# EAGLE design accra004 (EAGLE 5.03)
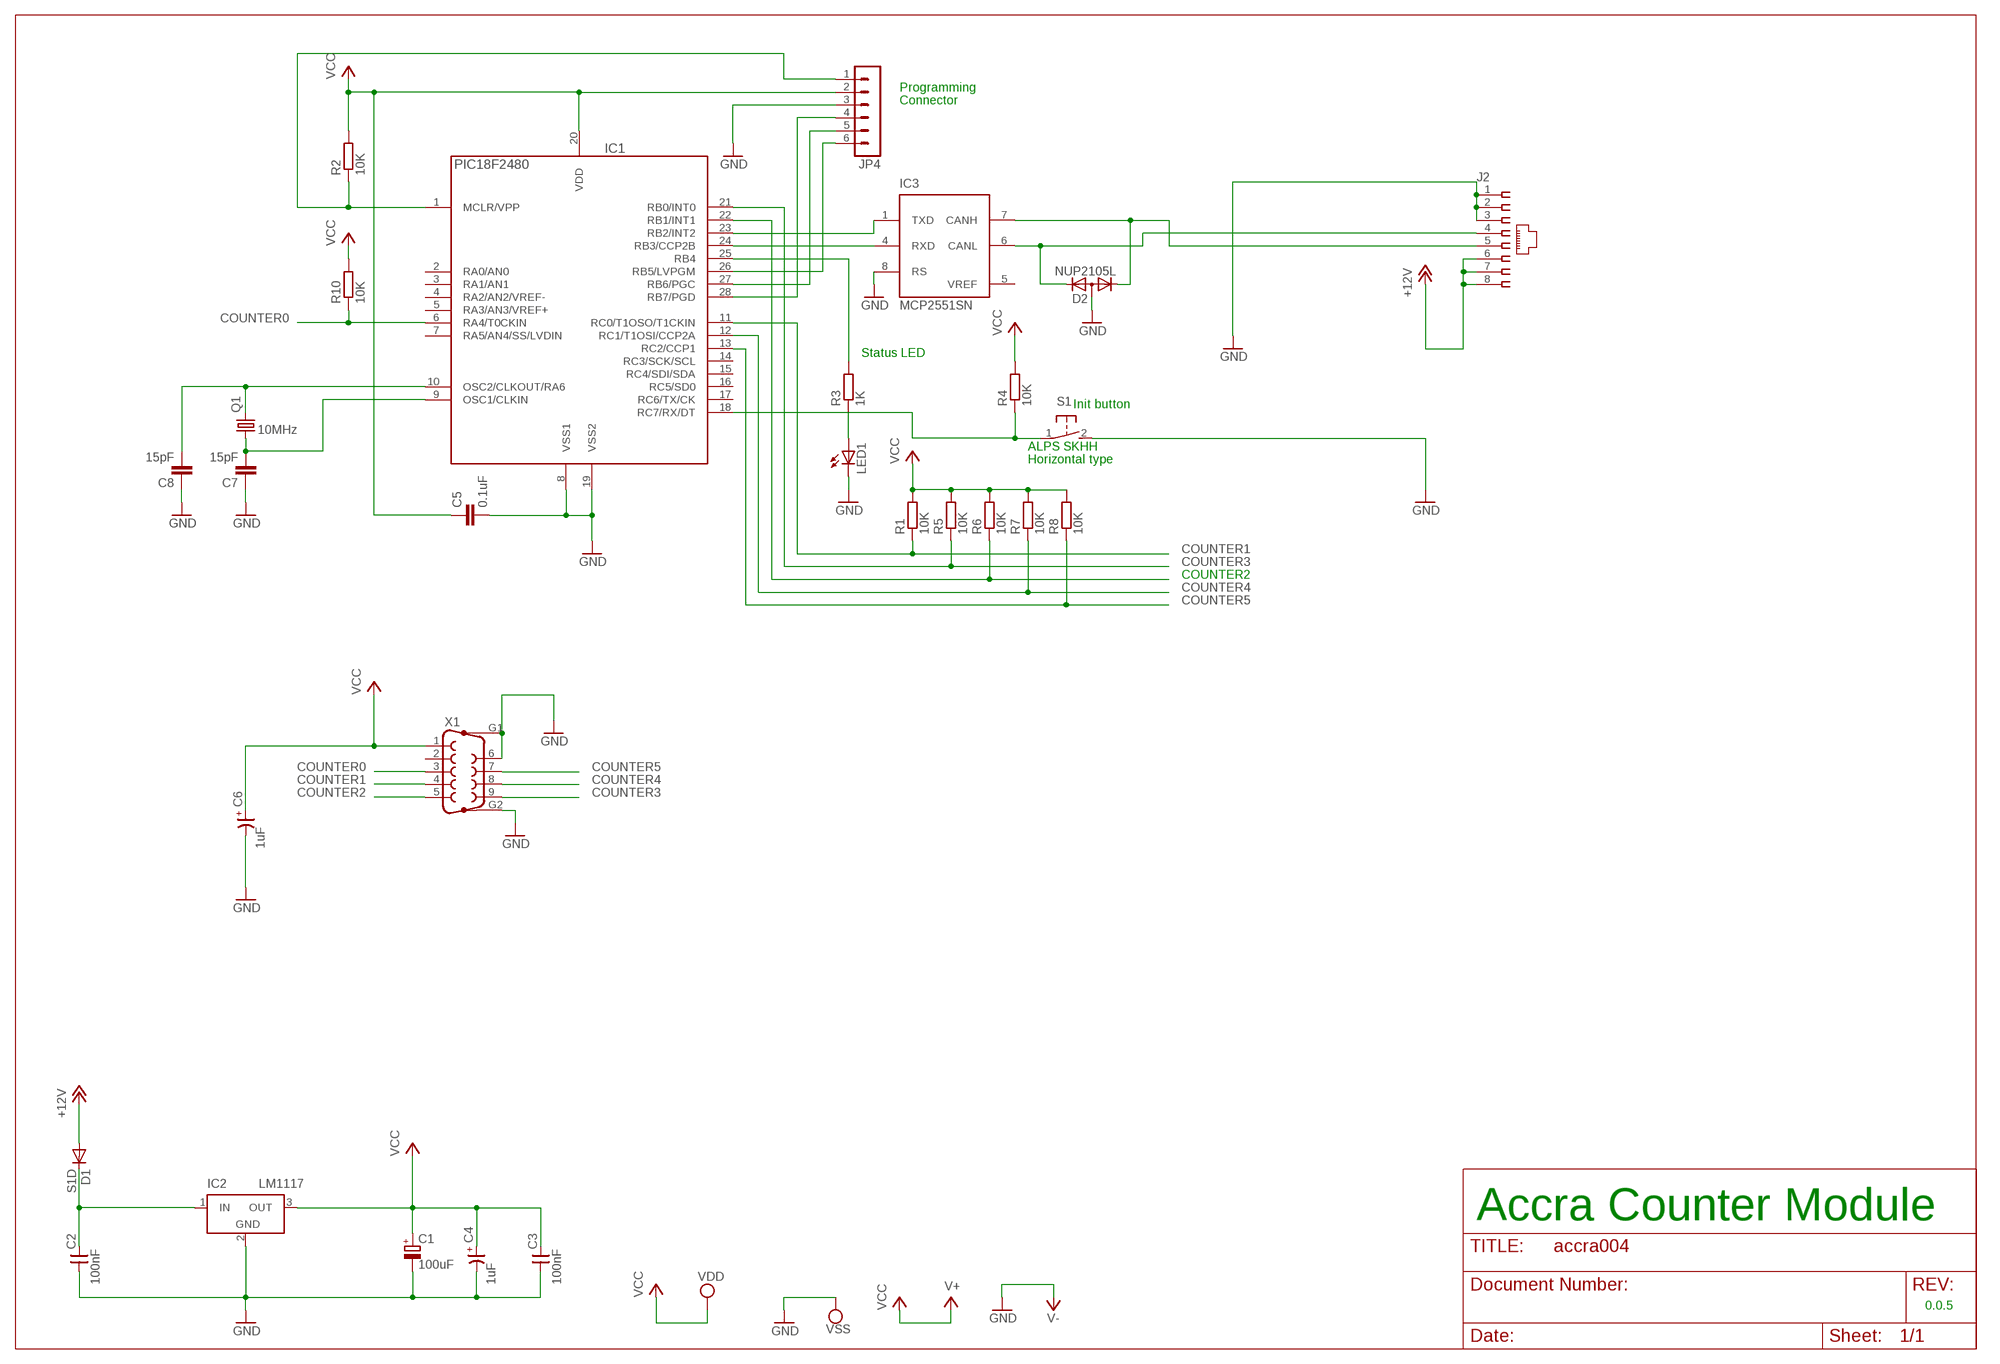
[diagram p0: schematic, sheet 1]

## Parts
C1  100uF  CPOL-EUD  [PANASONIC_D]
C2  100nF  CNP-0805  [0805]
C3  100nF  CNP-0805  [0805]
C4  1uF  CP-SV-A  [SV-A]
C5  0.1uF  C-EUC0805  [C0805]
C6  1uF  CP-SV-A  [SV-A]
C7  15pF  C-EUC0805  [C0805]
C8  15pF  C-EUC0805  [C0805]
D1  S1D  DIODE-SMB  [SMB]
D2  NUP2105L  DIODE-2CA|ACSOT23  [SOT23]
IC1  PIC18F2480  PIC18LF252-I/SO  [SO28]
IC2  LM1117  LM2937  [SOT223]
IC3  MCP2551SN  [SO-08]
J2  520426-4  [520426-4]
JP4  MA06-1  [MA06-1]
LED1  LED3MM  [LED3MM]
Q1  10MHz  CRYSTALSM49  [SM49]
R1  10K  R-EU_R0805  [R0805]
R2  10K  R-EU_R0805  [R0805]
R3  1K  R-EU_R0805  [R0805]
R4  10K  R-EU_R0805  [R0805]
R5  10K  R-EU_R0805  [R0805]
R6  10K  R-EU_R0805  [R0805]
R7  10K  R-EU_R0805  [R0805]
R8  10K  R-EU_R0805  [R0805]
R10  10K  R-EU_R0805  [R0805]
S1  31-XX  [B3F-31XX]
X1  F09HP  [F09HP]

## Nets
+12V: D1.A J2.6 J2.7 J2.8
CANH: D2.1(K1) IC3.7(CANH) J2.5
CANL: D2.2(K2) IC3.6(CANL) J2.4
COUNTER0: IC1.6(RA4/T0CKIN) R10.1 X1.3
COUNTER1: IC1.11(RC0/T1OSO/T1CKIN) R1.1 X1.4
COUNTER2: IC1.22(RB1/INT1) R6.1 X1.5
COUNTER3: IC1.21(RB0/INT0) R5.1 X1.9
COUNTER4: IC1.12(RC1/T1OSI/CCP2A) R7.1 X1.8
COUNTER5: IC1.13(RC2/CCP1) R8.1 X1.7
GND: C1.- C2.1 C3.1 C4.- C5.2 C6.- C7.1 C8.1 D2.3(A) IC1.8(VSS1) IC1.19(VSS2) IC2.2(GND) IC3.8(RS) J2.1 J2.2 J2.3 JP4.3 LED1.K(C) S1.2(S) X1.6 X1.G1 X1.G2 ; supply symbol labelled VSS, V-
N$2: C2.2 D1.C IC2.1(IN)
N$4: IC1.25(RB4) R3.2
N$5: LED1.A R3.1
N$7: C8.2 IC1.10(OSC2/CLKOUT/RA6) Q1.2
N$12: IC1.1(MCLR/VPP) JP4.1 R2.1
N$13: IC1.28(RB7/PGD) JP4.4
N$14: IC1.27(RB6/PGC) JP4.5
N$15: IC1.26(RB5/LVPGM) JP4.6
N$16: C7.2 IC1.9(OSC1/CLKIN) Q1.1
N$24: IC1.18(RC7/RX/DT) R4.1 S1.1(P)
RXCAN: IC1.24(RB3/CCP2B) IC3.4(RXD)
TXCAN: IC1.23(RB2/INT2) IC3.1(TXD)
VCC: C1.+ C3.2 C4.+ C5.1 C6.+ IC1.20(VDD) IC2.3(OUT) JP4.2 R1.2 R2.2 R4.2 R5.2 R6.2 R7.2 R8.2 R10.2 X1.1 ; supply symbol labelled VDD, V+
Unconnected: IC1.2(RA0/AN0) IC1.3(RA1/AN1) IC1.4(RA2/AN2/VREF-) IC1.5(RA3/AN3/VREF+) IC1.7(RA5/AN4/SS/LVDIN) IC1.14(RC3/SCK/SCL) IC1.15(RC4/SDI/SDA) IC1.16(RC5/SD0) IC1.17(RC6/TX/CK) X1.2

## Notes on the sheet
- Programming
- Connector
- Status LED
- Init button
- ALPS SKHH
- Horizontal type
- Accra Counter Module
- 0.0.5

## Power pins joined to a net without a drawn wire
GND: IC2.4(GND) IC3.2(VSS)
VCC: IC3.3(VDD)
VREF: IC3.5(VREF)

## Library data of the parts
C1 = rcl:CPOL-EU: POLARIZED CAPACITOR, European symbol
C2 C3 = cap-master:CNP-: NON-POLARIZED CAP
C4 C6 = cap-master:CP-: POLARIZED CAP
C5 C7 C8 = rcl:C-EU: CAPACITOR, European symbol
D1 = diode:DIODE-: DIODE
D2 = diode:DIODE-2CA|AC: Dual DIODE Cathode-Anode|Anode-Cathode
IC1 = pic_olin:PIC18*F252-?: 18F252, 28 pin, 32Kb prog, 1536 data, 256 EEPROM
IC2 = eurosource:LM2937
IC3 = microchip_can:MCP2551: High Speed CAN tranceiver
J2 = con-amp:520426-4: AMP connector
JP4 = con-lstb:MA06-1: PIN HEADER
LED1 = led:LED: LED OSRAM: - CHIPLED LG R971, LG N971, LY N971, LG Q971, LY Q971, LO R971, LY R971 LH N974, LH R974 LS Q976, LO Q976, LY Q976 LO Q996 - Hyper CHIPLED LW Q18S LB Q993, LB Q99A, LB R99A - SideLED LS A670, LO A670, LY A670, LG A670, LP A670 LB A673, LV A673, LT A673, LW A673 LH A674 LY A675 LS A676, LA A676, LO A676, LY A676, LW A676 LS A679, LY A679, LG A679 - Hyper Micro SIDELED® LS Y876, LA Y876, LO Y876, LY Y876 LT Y87S - SmartLED LW L88C, LW L88S LB L89C, LB L89S, LG L890 LS L89K, LO L89K, LY L89K LS L896, LA L896, LO L896, LY L896 - TOPLED LS T670, LO T670, LY T670, LG T670, LP T670 LSG T670, LSP T670, LSY T670, LOP T670, LYG T670 LG T671, LOG T671, LSG T671 LB T673, LV T673, LT T673, LW T673 LH T674 LS T676, LA T676, LO T676, LY T676, LB T676, LH T676, LSB T676, LW T676 LB T67C, LV T67C, LT T67C, LS T67K, LO T67K, LY T67K, LW E67C LS E67B, LA E67B, LO E67B, LY E67B, LB E67C, LV E67C, LT E67C LW T67C LS T679, LY T679, LG T679 LS T770, LO T770, LY T770, LG T770, LP T770 LB T773, LV T773, LT T773, LW T773 LH T774 LS E675, LA E675, LY E675, LS T675 LS T776, LA T776, LO T776, LY T776, LB T776 LHGB T686 LT T68C, LB T68C - Hyper Mini TOPLED® LB M676 - Mini TOPLED Santana® LG M470 LS M47K, LO M47K, LY M47K Source: http://www.osram.convergy.de - LUMILED® LXK2-PW12-R00, LXK2-PW12-S00, LXK2-PW14-U00, LXK2-PW14-V00 LXK2-PM12-R00, LXK2-PM12-S00, LXK2-PM14-U00 LXK2-PE12-Q00, LXK2-PE12-R00, LXK2-PE12-S00, LXK2-PE14-T00, LXK2-PE14-U00 LXK2-PB12-K00, LXK2-PB12-L00, LXK2-PB12-M00, LXK2-PB14-N00, LXK2-PB14-P00, LXK2-PB14-Q00 LXK2-PR12-L00, LXK2-PR12-M00, LXK2-PR14-Q00, LXK2-PR14-R00 LXK2-PD12-Q00, LXK2-PD12-R00, LXK2-PD12-S00 LXK2-PH12-R00, LXK2-PH12-S00 LXK2-PL12-P00, LXK2-PL12-Q00, LXK2-PL12-R00 Source: www.luxeon.com
Q1 = crystal:CRYSTAL: CRYSTAL
R1-R8 R10 = rcl:R-EU_: RESISTOR, European symbol
S1 = switch-omron:31-XX: OMRON SWITCH
X1 = con-subd:F09HP: SUB-D

## Board
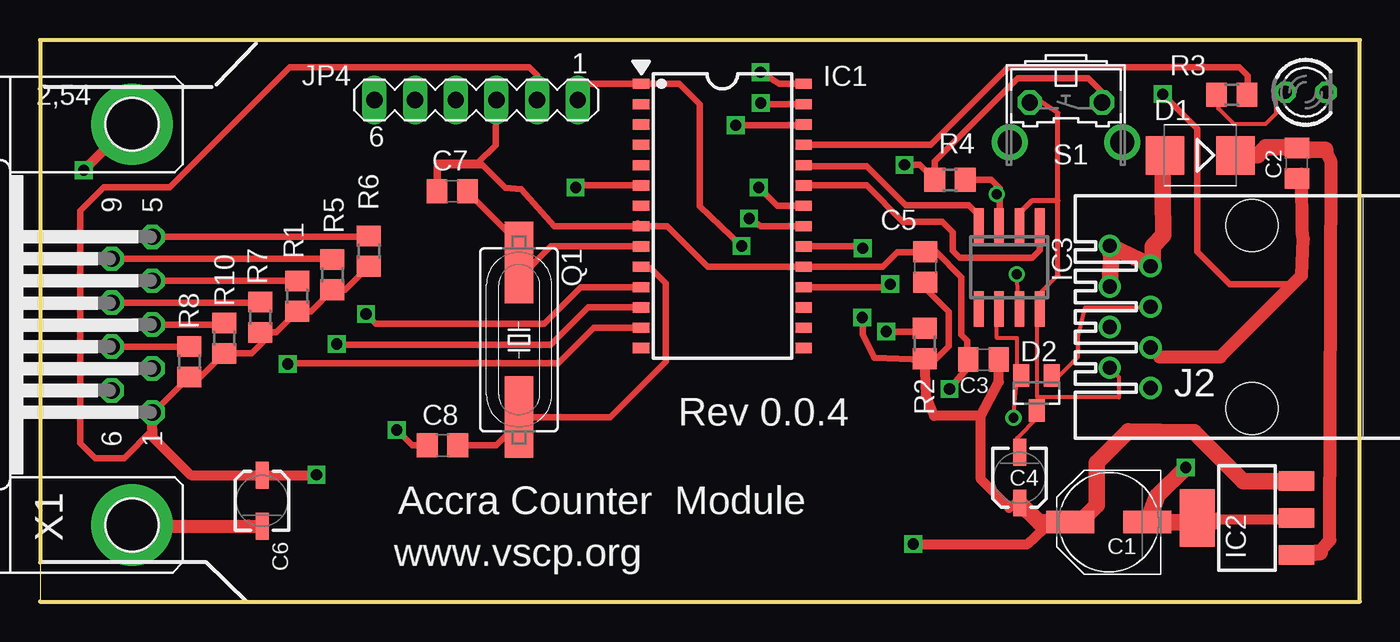
[diagram p1: board, top side]
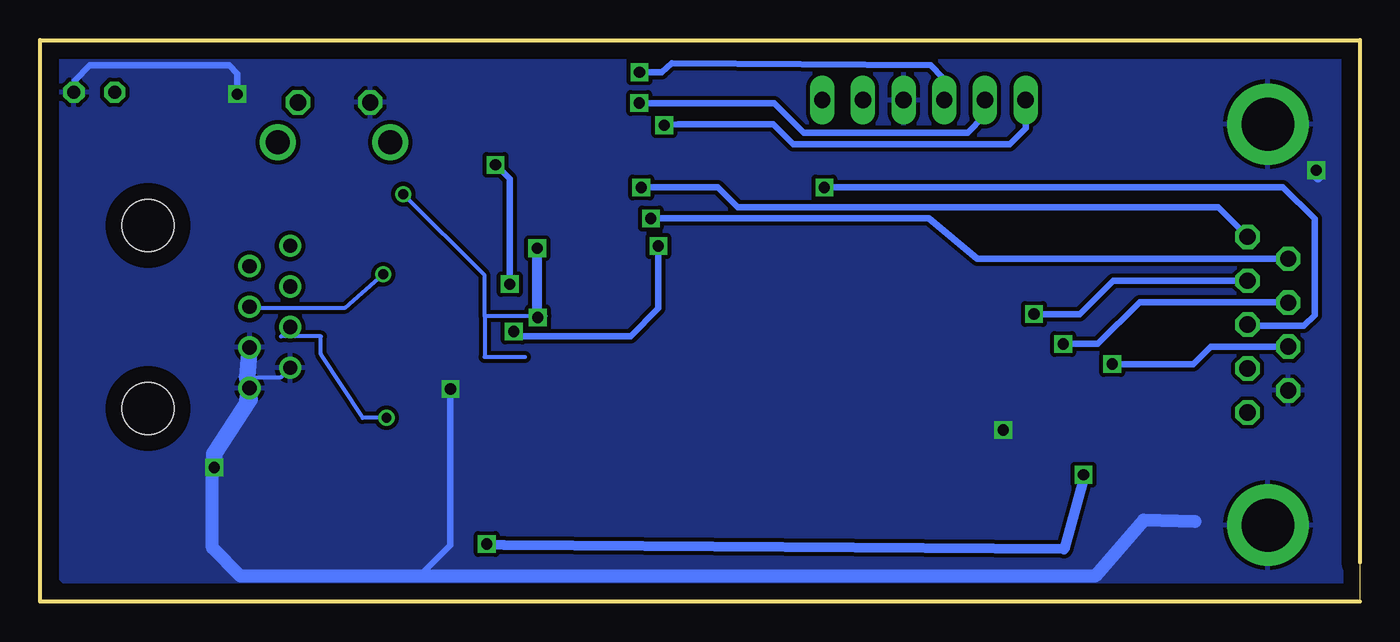
[diagram p2: board, bottom side, seen from below]

Size 82.46 x 35.08 mm. Coordinates in mm from the lower left corner, seen from the top.
Outline: 0,0 82.46,0 82.46,35.08 0,35.08 0,2.45 0,0
Copper layers (1*16): Top 0.035mm / dielectric 1.5mm / Bottom 0.035mm
Design rules "10mils": minimum track width 10mil, minimum drill 24mil, track to track 10mil, track to pad 10mil, pad to pad 10mil, via to via 10mil, smd to smd 10mil, copper to edge 40mil, drill to drill 10mil, minimum pad ring 10mil, minimum via ring 8mil, stop-mask expansion 0mil, vias tented up to drill 0mil, thermal gap 10mil

### Footprints (pad centres in the part's own frame; a part is rotated, then mirrored left to right if it is on the bottom)
PANASONIC_D = smd 3 x 1.4: + 2.4,0; - -2.4,0
0805 = smd 1.27 x 1.524: 1 -0.953,0; 2 0.953,0
SV-A = smd 1.676 x 0.813: + -1.587,0; - 1.587,0
C0805 = smd 1.3 x 1.5: 1 -0.95,0; 2 0.95,0
SMB = smd 2.4 x 2.4: A 2.2,0; C -2.2,0
SOT23 = smd 1 x 1.4: 1 -0.95,-1.1; 2 0.95,-1.1; 3 0,1.1
SO28 = smd 0.635 x 1.016: 1 -8.255,-5.08; 2 -6.985,-5.08; 3 -5.715,-5.08; 4 -4.445,-5.08; 5 -3.175,-5.08; 6 -1.905,-5.08; 7 -0.635,-5.08; 8 0.635,-5.08; 9 1.905,-5.08; 10 3.175,-5.08; 11 4.445,-5.08; 12 5.715,-5.08; 13 6.985,-5.08; 14 8.255,-5.08; 15 8.255,5.08; 16 6.985,5.08; 17 5.715,5.08; 18 4.445,5.08; 19 3.175,5.08; 20 1.905,5.08; 21 0.635,5.08; 22 -0.635,5.08; 23 -1.905,5.08; 24 -3.175,5.08; 25 -4.445,5.08; 26 -5.715,5.08; 27 -6.985,5.08; 28 -8.255,5.08
SOT223 = smd 1.219 x 2.235: 1 -2.311,-3.099; 2 0,-3.099; 3 2.311,-3.099 | smd 3.6 x 2.2: 4 0,3.099
SO-08 = smd 0.6 x 2.2: 1 -1.905,-2.6; 2 -0.635,-2.6; 3 0.635,-2.6; 4 1.905,-2.6; 5 1.905,2.6; 6 0.635,2.6; 7 -0.635,2.6; 8 -1.905,2.6
520426-4 = drill 0.889 round: 1 -4.445,6.35; 2 -3.175,8.89; 3 -1.905,6.35; 4 -0.635,8.89; 5 0.635,6.35; 6 1.905,8.89; 7 3.175,6.35; 8 4.445,8.89 | hole 3.251: -5.715,0; 5.715,0
MA06-1 = drill 1.016 long: 1 -6.35,0; 2 -3.81,0; 3 -1.27,0; 4 1.27,0; 5 3.81,0; 6 6.35,0
LED3MM = drill 0.813 octagon: A -1.27,0; K 1.27,0
SM49 = smd 5.08 x 1.778: 1 -4.826,0; 2 4.826,0
R0805 = smd 1.3 x 1.5: 1 -0.95,0; 2 0.95,0
B3F-31XX = drill 1.016 octagon: 1 -2.261,-1.245; 2 2.261,-1.245 | drill 1.499 pad 2.159 round: 3 -3.505,1.245; 4 3.505,1.245
F09HP = drill 1.016 octagon: 1 -5.486,-1.27; 2 -2.743,-1.27; 3 0,-1.27; 4 2.743,-1.27; 5 5.486,-1.27; 6 -4.115,1.27; 7 -1.372,1.27; 8 1.372,1.27; 9 4.115,1.27 | drill 3.302 pad 5.08 round: G1 -12.522,0; G2 12.522,0

### Placement (x,y rotation side)
C1  66.77,4.96 180 top
C2  78.52,27.38 90 top
C3  58.94,15.11 0 top
C4  61.19,7.74 90 top
C5  55.3,20.9 90 top
C6  13.87,6.3 270 top
C7  25.75,25.64 0 top
C8  25.14,9.75 0 top
D1  72.48,27.87 180 top
D2  62.26,13.03 180 top
IC1  42.63,24.09 270 top
IC2  75.4,5.22 90 top
IC3  60.55,20.88 180 top
J2  75.72,17.78 90 top
JP4  27.24,31.33 180 top
LED1  79.07,31.82 0 top
Q1  29.92,16.35 270 top
R1  16.07,19.08 270 top
R2  55.27,16.12 270 top
R3  74.45,31.66 0 top
R4  56.85,26.34 0 top
R5  18.27,20.42 270 top
R6  20.55,21.89 270 top
R7  13.76,17.76 270 top
R8  9.33,14.98 270 top
R10  11.51,16.45 270 top
S1  64.09,29.94 180 top
X1  5.75,17.3 90 top

### Tracks (layer width: path | path; a pad name or v marks a point on that pad's centre or on a via)
+12V
  Top 1.016: 66.91,21.54 66.91,21.65 | 66.91,21.54 J2.8 69.39,21.03 J2.7 | J2.6 66.84,19.85 66.91,21.54 | J2.7 69.3,21.1 | D1.A 70.12,27.87 70.17,22.88 69.5,22.21 69.5,20.98 J2.7
CANH  (via drill 0.61)
  Top 0.254: D2.1 63.58,14.02 64.85,15.29 64.85,16.56 65.31,18.38 69.12,18.38 J2.5 | v61.02,20.45 61.04,19.1 IC3.7
  Bottom 0.254: v61.02,20.45 63.39,18.36 69.74,18.36 J2.5
CANL  (via drill 0.61)
  Top 0.254: 61.04,14.02 61.04,16.45 59.77,16.45 59.77,17.83 IC3.6 | v60.81,11.48 61.04,14.02 | 61.04,14.02 D2.2
  Bottom 0.254: v60.81,11.48 62.31,11.48 64.91,15.46 64.91,16.56 67.39,16.56 J2.4
COUNTER0  (via drill 0.7)
  Top 0.406: X1.3 11.41,17.3 R10.1 | IC1.6 33.59,26 v33.46,25.87
  Bottom 0.406: v33.46,25.87 4.81,25.87 2.84,23.9 2.84,17.9 3.51,17.23 6.95,17.23 X1.3
COUNTER1  (via drill 0.7)
  Top 0.406: X1.4 16.06,20.04 R1.1 | IC1.11 33.8,19.64 31.49,17.34 20.98,17.34 v20.36,17.96
  Bottom 0.406: v20.36,17.96 17.5,17.96 15.42,20.04 X1.4
COUNTER2  (via drill 0.7)
  Top 0.406: X1.5 20.5,22.79 R6.1 | IC1.22 46.05,24.73 v44.9,25.87
  Bottom 0.406: v44.9,25.87 40.12,25.87 38.87,24.62 8.85,24.62 X1.5
COUNTER3  (via drill 0.7)
  Top 0.406: X1.9 18.22,21.41 R5.1 | IC1.21 45.03,23.46 v44.3,23.93
  Bottom 0.406: v44.3,23.93 26.94,23.93 23.92,21.42 4.62,21.42 X1.9
COUNTER4  (via drill 0.7)
  Top 0.406: X1.8 13.72,18.67 R7.1 | IC1.12 34.24,18.38 31.9,16.03 18.6,16.03 v18.54,16.09
  Bottom 0.406: v18.54,16.09 16.38,16.09 R7.1 4.52,18.71 X1.8
COUNTER5  (via drill 0.7)
  Top 0.406: X1.7 R8.1 | IC1.13 34.59,17.11 32.37,14.89 15.52,14.89 v15.47,14.84
  Bottom 0.406: v15.47,14.84 10.42,14.84 R8.1 4.97,15.93 X1.7
GND  (via drill 0.7)
  Top 0.254: 62.31,11.48 61.04,10.21 61.04,8.94 C4.- | 62.31,12.75 62.31,11.48 | 62.31,12.75 62.31,17.83 IC3.8 62.31,19.1 63.58,20.37 | 62.31,11.48 D2.3 | 62.31,12.75 67.39,12.75 67.39,14.02 J2.2 | 77.55,5.13 IC2.2 | 78.82,26.72 C2.1
  Top 0.305: 63.58,20.37 63.58,25.06 | 63.58,25.06 63.58,30.53 62.4,31.31 S1.2 | 61.18,24.25 61.97,25.03 63.47,25.03 63.5,25.06 63.58,25.06
  Top 0.406: 61.18,24.25 IC3.2 | v70.14,31.7 72.29,29.55 72.29,21.84 74.32,19.81 78.01,19.81 78.35,20.15 78.58,20.15 78.95,20.52 78.95,26.69 78.89,26.75 78.86,26.72 78.82,26.72 | 57.93,16.29 57.56,16.66 57.56,20.27 55.98,21.85 C5.2 55.3,21.82 | C3.1 58.07,15.2 57.93,15.34 57.93,16.29 | 55.3,21.82 55.43,21.69 | 55.3,21.82 55.29,21.83 53.56,21.83 52.64,20.91 IC1.19 41.71,20.91 39.17,23.46 37.5,23.46 | 13.03,4.71 13.03,4.66 13.1,4.73 | 24.8,25.45 24.79,25.44 | 24.8,25.45 C7.1 24.8,27.13 24.92,27.25 27.65,27.25 29.05,25.85 30.05,25.75 32.11,23.46 37.77,23.46 | 24.8,25.45 24.85,25.5 24.85,27.42 27.35,27.42 28.47,28.51 28.51,31.08 JP4.3 28.51,31.16 28.6,31.07 28.6,32.1 | 37.77,23.46 37.87,23.36 | 37.77,23.46 IC1.8 37.5,23.46 | 37.5,23.46 37.33,23.63 | 57.93,16.29 57.93,14.58 v56.82,13.28 | C8.1 23.25,9.75 v22.28,10.72
  Top 0.61: 73.53,5.26 73.23,4.96 73.74,5.13 77.55,5.13 | J2.3 69.93,15.29 | 5.76,4.78 6.02,4.52 | X1.G1 5.76,4.78 | 5.76,4.78 4.48,6.06 | X1.G2 5.61,29.82 v2.73,26.94
  Top 0.813: 78.82,26.72 78.86,23.03 78.92,22.65 78.82,20.37 73.74,15.29 69.93,15.29 | 5.72,4.8 8.1,4.78 | X1.G1 5.72,4.8 | C6.- 13.03,4.71 8.1,4.71 5.72,4.8
  Top 1.016: v71.58,8.37 69.81,6.6 C1.- 73.03,4.96 72.99,5 IC2.4 72.99,5.2 73.23,4.96
  Bottom 0.254: J2.2 67.39,14.02 69.5,14.02 69.93,14.02 | v71.58,8.37 71.2,8.94 71.7,8.31
  Bottom 0.406: v70.14,31.7 70.14,32.98 70.65,33.49 79.36,33.49 80.3,32.55 80.3,31.93 80.34,31.89 LED1.K | 58.73,1.59 58.73,1.62 56.82,3.53 v56.82,13.28
  Bottom 0.61: v2.73,26.94 2.73,26.6 2.63,26.5
  Bottom 0.813: 71.7,8.31 71.7,3.35 69.94,1.59 58.73,1.59 16.55,1.59 13.51,5.08 10.3,4.99 | X1.G1 7.9,4.97
  Bottom 1.016: J2.1 69.5,14.02 J2.3 | J2.1 69.5,12.55 69.52,12.53 | J2.1 69.39,12.65 69.37,12.63 71.58,9.22 v71.58,8.37
  pour Bottom: 0.67,34.09 0.67,1.45 1.26,0.86 80.55,0.86 81.52,1.83 81.52,34.32 81.59,34.39 1.04,34.39 0.82,34.17
N$2
  Top 0.813: 79.96,3.07 80.58,3.83 80.66,27.47 80.29,28.22
  Top 1.016: D1.C 76.08,27.87 76.58,28.37 78.49,28.37 C2.2 78.64,28.22 80.29,28.22 | IC2.1 79.96,3.07
N$4
  Top 0.406: IC1.25 55.63,28.54 60.48,33.38 74.92,33.38 75.45,32.85 75.45,31.55 | 75.45,31.55 75.4,31.6 R3.2 | 75.45,31.55 75.51,31.49
N$5
  Top 0.254: R3.1 73.6,30.81 74.57,29.84 76.56,29.84 77.24,30.52 77.24,31.35 77.75,31.86 LED1.A
N$7
  Top 0.406: C8.2 28.5,9.75 30.06,11.31 29.92,11.45 Q1.2 35.61,11.52 39.08,14.99 39.08,19.88 38.14,20.82 37.64,20.82 IC1.10
N$12  (via drill 0.7)
  Top 0.254: R2.1 54.69,16.56
  Top 0.406: 33.59,31.3 33.68,31.21 | 33.59,31.3 JP4.1 | 33.59,31.3 33.58,31.31 33.58,32.03 33.89,32.34 IC1.1 39.93,32.34 41.21,31.07 41.21,24.71 v43.83,22.21 | R2.1 55.42,17.07 55.45,17.04 55.28,16.87 v52.86,16.87
  Bottom 0.406: v43.83,22.21 43.83,18.31 45.57,16.57 52.56,16.57 v52.86,16.87
N$13  (via drill 0.7)
  Top 0.406: IC1.28 46.17,32.34 v45.01,33.06
  Bottom 0.406: v45.01,33.06 43.62,33.06 43.01,33.64 26.83,33.49 26.05,32.71 26.05,31.34 26.04,31.33 JP4.4
N$14  (via drill 0.7)
  Top 0.406: IC1.27 45.09,31.07 v45.03,31.14
  Bottom 0.406: v45.03,31.14 36.58,31.14 34.74,29.3 24.51,29.3 23.49,30.32 23.49,31.45 23.43,31.39 JP4.5
N$15  (via drill 0.7)
  Top 0.406: 47.83,29.77 47.8,29.8 IC1.26 | v43.46,29.75 47.83,29.77 | 47.83,29.77 47.86,29.74
  Bottom 0.406: JP4.6 20.89,29.58 21.89,28.58 35.41,28.58 36.64,29.81 42.6,29.81 v43.46,29.75
N$16
  Top 0.406: IC1.9 31.91,22.19 30.08,20.35 | 30.08,20.35 30.02,20.29 | C7.2 26.7,25.61 29.92,22.39 Q1.1 29.92,20.51 30.08,20.35
N$24  (via drill 0.7)
  Top 0.406: IC1.18 52.93,19.64 v53.12,19.83 | v54,27.28 54.96,27.28 R4.1 55.9,27.52 61.07,32.69 65.5,32.69 66.43,31.76 66.43,31.26 S1.1
  Bottom 0.406: v53.12,19.83 53.12,26.4 v54,27.28
RXCAN
  Top 0.406: IC3.4 58.64,24.14 58.02,24.76 54.08,24.76 51.66,27.18 47.65,27.18 47.6,27.23 47.63,27.27 IC1.24
TXCAN
  Top 0.406: IC1.23 51.63,26 53.9,23.73 56.37,23.73 57.02,23.08 57.02,21.92 57.45,21.49 61.99,21.49 62.44,21.94 62.44,23.39 62.47,23.42 62.45,23.44 IC3.1
VCC  (via drill 0.61, 0.7)
  Top 0.254: v59.77,25.45 59.97,25.45
  Top 0.406: C3.2 59.89,15.13 59.9,15.14 59.97,15.21 | C4.+ 61.38,6.15 61.39,6.14 61.11,5.86 60.54,5.86 | C5.1 55.3,19.58 56.77,18.11 56.77,15.95 56,15.18 55.34,15.18 55.32,15.2 55.29,15.17 R2.2 55.2,15.1 52.12,15.22 51.4,16.69 v51.37,17.75 | R4.2 59.44,26.34 59.97,25.81 59.97,25.45 59.97,24.01 59.89,23.93 59.91,23.91 IC3.3 | 14.12,7.89 14.15,7.86 | 14.12,7.89 C6.+ | 14.11,7.9 14.12,7.89 | 17.24,7.89 v17.27,7.92 17.52,8.17 | 63.18,4.94 63.18,4.96 | IC1.20 51.28,22.19 v51.4,22.07 | X1.1 7.11,11.81 R8.2 10.04,14.03 R10.2 13.22,15.5 14.07,16.35 14.07,16.5 R7.2 14.75,16.81 R1.2 16.93,18.13 R5.2 19.08,19.47 R6.2 | JP4.2 31.05,32.87 30.55,33.37 15.59,33.37 8.09,25.87 3.97,25.87 2.52,24.42 2.52,9.89 3.46,8.95 5.25,8.95 7.02,10.72
  Top 0.61: R2.2 55.36,12.87 55.85,11.6 58.77,11.61 | 58.77,11.61 59.9,13.72 59.9,15.14 | 58.77,11.61 58.77,7.63 60.54,5.86 | X1.1 7.02,10.72 7.02,10.3 9.42,7.9 14.11,7.9 | 14.12,7.89 17.24,7.89 | v54.55,3.59 61.69,3.59 63.18,4.94
  Top 1.016: C4.+ 61.22,6.15 62.41,4.96 63.18,4.96 C1.+ 65.01,5.01 66.01,6.01 66.01,8.67 67.97,10.63 72.1,10.57 75.16,7.51 IC2.3
  Bottom 0.254: v59.77,25.45 54.69,20.37 54.69,17.83 | 54.69,17.83 54.69,15.29 52.15,15.29 | 54.69,17.83 50.88,17.83 v51.37,17.75
  Bottom 0.406: v17.27,7.92 17.27,7.7
  Bottom 0.61: 17.27,7.7 18.49,3.26 53.48,3.52 v54.55,3.59 | v51.4,22.07 51.4,17.78 v51.37,17.75

### Text on the board
tNames: Rev 0.0.4 | Accra Counter Module | www.vscp.org